# Altium schematic sheet TOP.SchDoc
size A0
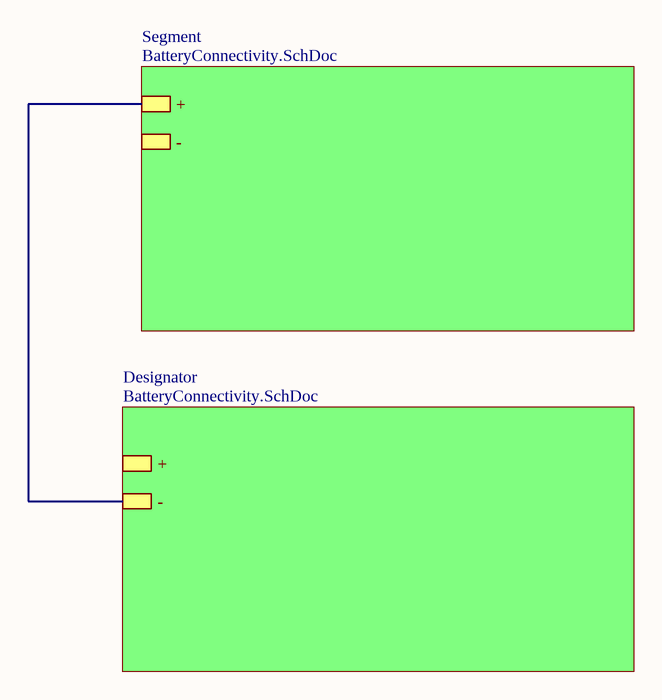
[diagram p0: TOP.SchDoc]

## Sub-sheets
Designator = BatteryConnectivity.SchDoc: +, -
Segment = BatteryConnectivity.SchDoc: +, -

## Nets
(unnamed): sheet Segment/+, sheet Designator/-